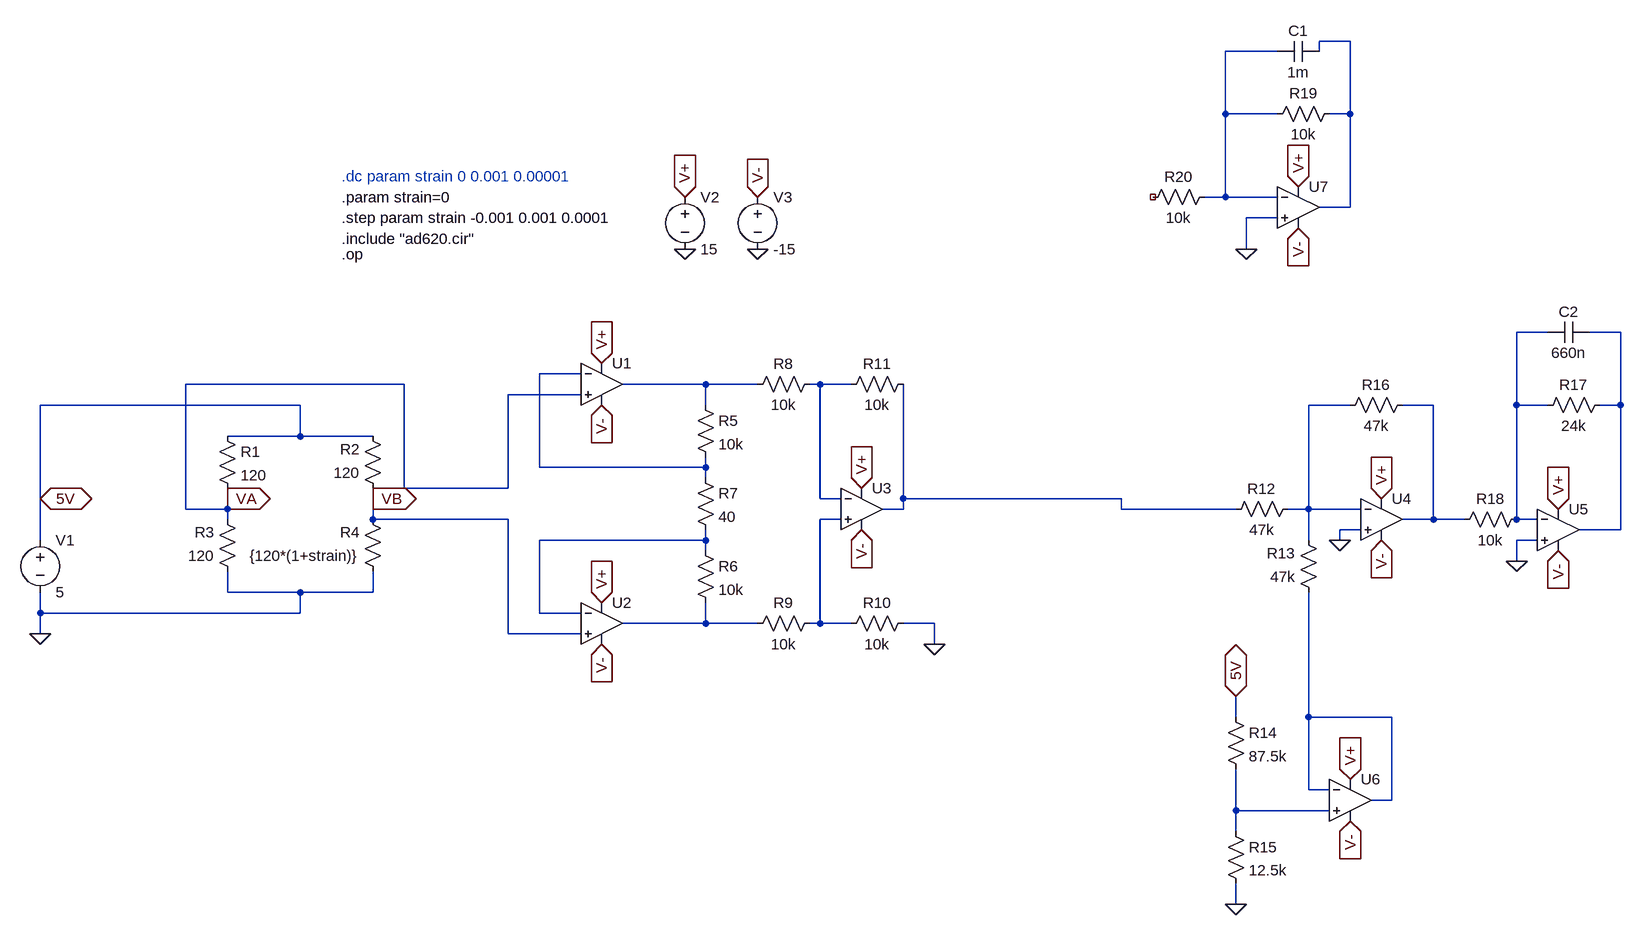
[diagram p0: schematic Strain_measurement.asc]
Strain_measurement.asc, the LTspice schematic file:
Version 4
SHEET 1 2328 736
WIRE 1904 -608 1856 -608
WIRE 1792 -592 1712 -592
WIRE 1856 -592 1856 -608
WIRE 1712 -496 1712 -592
WIRE 1792 -496 1712 -496
WIRE 1904 -496 1904 -608
WIRE 1904 -496 1872 -496
WIRE 1712 -368 1712 -496
WIRE 1712 -368 1680 -368
WIRE 1792 -368 1712 -368
WIRE 1904 -352 1904 -496
WIRE 1904 -352 1856 -352
WIRE 1792 -336 1744 -336
WIRE 1744 -288 1744 -336
WIRE 2208 -160 2160 -160
WIRE 2320 -160 2272 -160
WIRE 720 -96 656 -96
WIRE 448 -80 112 -80
WIRE 912 -80 784 -80
WIRE 992 -80 912 -80
WIRE 1088 -80 1072 -80
WIRE 1136 -80 1088 -80
WIRE 720 -64 608 -64
WIRE 288 -48 -112 -48
WIRE 912 -48 912 -80
WIRE 1904 -48 1840 -48
WIRE 2032 -48 1984 -48
WIRE 2160 -48 2160 -160
WIRE 2208 -48 2160 -48
WIRE 2320 -48 2320 -160
WIRE 2320 -48 2288 -48
WIRE 288 0 288 -48
WIRE 288 0 176 0
WIRE 400 0 288 0
WIRE 656 48 656 -96
WIRE 912 48 912 32
WIRE 912 48 656 48
WIRE 912 64 912 48
WIRE 448 80 448 -80
WIRE 608 80 608 -64
WIRE 608 80 448 80
WIRE -112 96 -112 -48
WIRE 176 96 176 80
WIRE 400 96 400 80
WIRE 1088 96 1088 -80
WIRE 1120 96 1088 96
WIRE 1216 96 1216 -80
WIRE 1552 96 1216 96
WIRE 112 112 112 -80
WIRE 176 112 176 96
WIRE 176 112 112 112
WIRE 1216 112 1216 96
WIRE 1216 112 1184 112
WIRE 1552 112 1552 96
WIRE 1728 112 1552 112
WIRE 1840 112 1840 -48
WIRE 1840 112 1808 112
WIRE 1920 112 1840 112
WIRE 176 128 176 112
WIRE 400 128 400 96
WIRE 608 128 400 128
WIRE 1120 128 1088 128
WIRE 2032 128 2032 -48
WIRE 2032 128 1984 128
WIRE 2080 128 2032 128
WIRE 2160 128 2160 -48
WIRE 2192 128 2160 128
WIRE 1920 144 1888 144
WIRE 2320 144 2320 -48
WIRE 2320 144 2256 144
WIRE -112 160 -112 96
WIRE 912 160 912 144
WIRE 912 160 656 160
WIRE 1840 160 1840 112
WIRE 1888 160 1888 144
WIRE 2192 160 2160 160
WIRE 912 176 912 160
WIRE 2160 192 2160 160
WIRE 176 240 176 208
WIRE 288 240 176 240
WIRE 400 240 400 208
WIRE 400 240 288 240
WIRE -112 272 -112 240
WIRE 288 272 288 240
WIRE 288 272 -112 272
WIRE 656 272 656 160
WIRE 720 272 656 272
WIRE 912 288 912 256
WIRE 912 288 784 288
WIRE 992 288 912 288
WIRE 1088 288 1088 128
WIRE 1088 288 1072 288
WIRE 1136 288 1088 288
WIRE 1264 288 1216 288
WIRE -112 304 -112 272
WIRE 608 304 608 128
WIRE 720 304 608 304
WIRE 1264 320 1264 288
WIRE 1728 432 1728 400
WIRE 1840 432 1840 240
WIRE 1968 432 1840 432
WIRE 1840 544 1840 432
WIRE 1872 544 1840 544
WIRE 1968 560 1968 432
WIRE 1968 560 1936 560
WIRE 1728 576 1728 512
WIRE 1872 576 1728 576
WIRE 1728 608 1728 576
WIRE 1728 720 1728 688
FLAG -112 304 0
FLAG 880 -288 0
FLAG 992 -288 0
FLAG 880 -368 V+
IOPIN 880 -368 In
FLAG 992 -368 V-
IOPIN 992 -368 In
FLAG 176 96 VA
IOPIN 176 96 Out
FLAG 400 96 VB
IOPIN 400 96 Out
FLAG 752 -112 V+
IOPIN 752 -112 In
FLAG 752 256 V+
IOPIN 752 256 In
FLAG 1152 80 V+
IOPIN 1152 80 In
FLAG 752 -48 V-
IOPIN 752 -48 In
FLAG 752 320 V-
IOPIN 752 320 In
FLAG 1152 144 V-
IOPIN 1152 144 In
FLAG 1264 320 0
FLAG 1952 96 V+
IOPIN 1952 96 In
FLAG 1952 160 V-
IOPIN 1952 160 In
FLAG -112 96 5V
IOPIN -112 96 BiDir
FLAG 1728 400 5V
IOPIN 1728 400 BiDir
FLAG 1728 720 0
FLAG 1888 160 0
FLAG 2160 192 0
FLAG 2224 176 V-
IOPIN 2224 176 In
FLAG 2224 112 V+
IOPIN 2224 112 In
FLAG 1904 528 V+
IOPIN 1904 528 In
FLAG 1904 592 V-
IOPIN 1904 592 In
FLAG 1824 -384 V+
IOPIN 1824 -384 In
FLAG 1824 -320 V-
IOPIN 1824 -320 In
FLAG 1744 -288 0
SYMBOL res 160 -16 R0
SYMATTR InstName R1
SYMATTR Value 120
SYMBOL res 192 224 R180
WINDOW 0 36 76 Left 2
WINDOW 3 36 40 Left 2
SYMATTR InstName R3
SYMATTR Value 120
SYMBOL res 416 224 R180
WINDOW 0 36 76 Left 2
WINDOW 3 36 40 Left 2
SYMATTR InstName R4
SYMATTR Value {120*(1+strain)}
SYMBOL res 416 96 R180
WINDOW 0 36 76 Left 2
WINDOW 3 36 40 Left 2
SYMATTR InstName R2
SYMATTR Value 120
SYMBOL voltage -112 144 R0
WINDOW 123 0 0 Left 0
WINDOW 39 0 0 Left 0
SYMATTR InstName V1
SYMATTR Value 5
SYMBOL voltage 880 -384 R0
SYMATTR InstName V2
SYMATTR Value 15
SYMBOL voltage 992 -384 R0
SYMATTR InstName V3
SYMATTR Value -15
SYMBOL OpAmps/UniversalOpAmp2 752 -80 R0
SYMATTR InstName U1
SYMBOL OpAmps/UniversalOpAmp2 752 288 R0
SYMATTR InstName U2
SYMBOL OpAmps/UniversalOpAmp2 1152 112 R0
SYMATTR InstName U3
SYMBOL Res 896 -64 R0
SYMATTR InstName R5
SYMATTR Value 10k
SYMBOL Res 896 160 R0
SYMATTR InstName R6
SYMATTR Value 10k
SYMBOL Res 896 48 R0
SYMATTR InstName R7
SYMATTR Value 40
SYMBOL Res 1088 -96 R90
WINDOW 0 0 56 VBottom 2
WINDOW 3 32 56 VTop 2
SYMATTR InstName R8
SYMATTR Value 10k
SYMBOL Res 1088 272 R90
WINDOW 0 0 56 VBottom 2
WINDOW 3 32 56 VTop 2
SYMATTR InstName R9
SYMATTR Value 10k
SYMBOL Res 1232 272 R90
WINDOW 0 0 56 VBottom 2
WINDOW 3 32 56 VTop 2
SYMATTR InstName R10
SYMATTR Value 10k
SYMBOL Res 1232 -96 R90
WINDOW 0 0 56 VBottom 2
WINDOW 3 32 56 VTop 2
SYMATTR InstName R11
SYMATTR Value 10k
SYMBOL OpAmps/UniversalOpAmp2 1952 128 R0
SYMATTR InstName U4
SYMBOL Res 1712 416 R0
SYMATTR InstName R14
SYMATTR Value 87.5k
SYMBOL Res 1712 592 R0
SYMATTR InstName R15
SYMATTR Value 12.5k
SYMBOL Res 1824 96 R90
WINDOW 0 0 56 VBottom 2
WINDOW 3 32 56 VTop 2
SYMATTR InstName R12
SYMATTR Value 47k
SYMBOL Res 1856 256 R180
WINDOW 0 36 76 Left 2
WINDOW 3 36 40 Left 2
SYMATTR InstName R13
SYMATTR Value 47k
SYMBOL Res 1888 -32 R270
WINDOW 0 32 56 VTop 2
WINDOW 3 0 56 VBottom 2
SYMATTR InstName R16
SYMATTR Value 47k
SYMBOL OpAmps/UniversalOpAmp2 2224 144 R0
SYMATTR InstName U5
SYMBOL Res 2304 -64 R90
WINDOW 0 0 56 VBottom 2
WINDOW 3 32 56 VTop 2
SYMATTR InstName R17
SYMATTR Value 24k
SYMBOL Res 2176 112 R90
WINDOW 0 0 56 VBottom 2
WINDOW 3 32 56 VTop 2
SYMATTR InstName R18
SYMATTR Value 10k
SYMBOL OpAmps/UniversalOpAmp2 1904 560 R0
SYMATTR InstName U6
SYMBOL OpAmps/UniversalOpAmp2 1824 -352 R0
SYMATTR InstName U7
SYMBOL Res 1888 -512 R90
WINDOW 0 0 56 VBottom 2
WINDOW 3 32 56 VTop 2
SYMATTR InstName R19
SYMATTR Value 10k
SYMBOL Cap 1856 -608 R90
WINDOW 0 0 32 VBottom 2
WINDOW 3 32 32 VTop 2
SYMATTR InstName C1
SYMATTR Value 1m
SYMBOL Res 1696 -384 R90
WINDOW 0 0 56 VBottom 2
WINDOW 3 32 56 VTop 2
SYMATTR InstName R20
SYMATTR Value 10k
SYMBOL Cap 2272 -176 R90
WINDOW 0 0 32 VBottom 2
WINDOW 3 32 32 VTop 2
SYMATTR InstName C2
SYMATTR Value 660n
TEXT 352 -304 Left 2 !.include "ad620.cir"
TEXT 352 -368 Left 2 !.param strain=0
TEXT 352 -336 Left 2 !.step param strain -0.001 0.001 0.0001
TEXT 352 -280 Left 2 !.op
TEXT 352 -400 Left 2 ;.dc param strain 0 0.001 0.00001

The netlist it stands for:
* Strain_measurement.asc
R1 5V VA 120
R3 0 VA 120
R4 0 VB {120*(1+strain)}
R2 VB 5V 120
V1 5V 0 5
V2 V+ 0 15
V3 V- 0 -15
XU1 VA N005 V+ V- N006 level2 Avol=1Meg GBW=10Meg Slew=10Meg Ilimit=25m Rail=0 Vos=0 En=0 Enk=0 In=0 Ink=0 Rin=500Meg  ; pins In+ In- V+ V- OUT
XU2 VB N012 V+ V- N013 level2 Avol=1Meg GBW=10Meg Slew=10Meg Ilimit=25m Rail=0 Vos=0 En=0 Enk=0 In=0 Ink=0 Rin=500Meg  ; pins In+ In- V+ V- OUT
XU3 N011 N007 V+ V- N010 level2 Avol=1Meg GBW=10Meg Slew=10Meg Ilimit=25m Rail=0 Vos=0 En=0 Enk=0 In=0 Ink=0 Rin=500Meg  ; pins In+ In- V+ V- OUT
R5 N006 N005 10k
R6 N012 N013 10k
R7 N005 N012 40
R8 N007 N006 10k
R9 N011 N013 10k
R10 0 N011 10k
R11 N010 N007 10k
XU4 0 N008 V+ V- N009 level2 Avol=1Meg GBW=10Meg Slew=10Meg Ilimit=25m Rail=0 Vos=0 En=0 Enk=0 In=0 Ink=0 Rin=500Meg  ; pins In+ In- V+ V- OUT
R14 5V N015 87.5k
R15 N015 0 12.5k
R12 N008 N010 47k
R13 N014 N008 47k
R16 N008 N009 47k
XU5 0 N003 V+ V- N004 level2 Avol=1Meg GBW=10Meg Slew=10Meg Ilimit=25m Rail=0 Vos=0 En=0 Enk=0 In=0 Ink=0 Rin=500Meg  ; pins In+ In- V+ V- OUT
R17 N004 N003 24k
R18 N003 N009 10k
XU6 N015 N014 V+ V- N014 level2 Avol=1Meg GBW=10Meg Slew=10Meg Ilimit=25m Rail=0 Vos=0 En=0 Enk=0 In=0 Ink=0 Rin=500Meg  ; pins In+ In- V+ V- OUT
XU7 0 N002 V+ V- N001 level2 Avol=1Meg GBW=10Meg Slew=10Meg Ilimit=25m Rail=0 Vos=0 En=0 Enk=0 In=0 Ink=0 Rin=500Meg  ; pins In+ In- V+ V- OUT
R19 N001 N002 10k
C1 N001 N002 1m
R20 N002 NC_01 10k
C2 N004 N003 660n
.include "ad620.cir"
.param strain=0
.step param strain -0.001 0.001 0.0001
.op
* .dc param strain 0 0.001 0.00001
.lib UniversalOpAmp2.lib
.backanno
.end